# EAGLE design POV3_singleside (EAGLE 6.4)
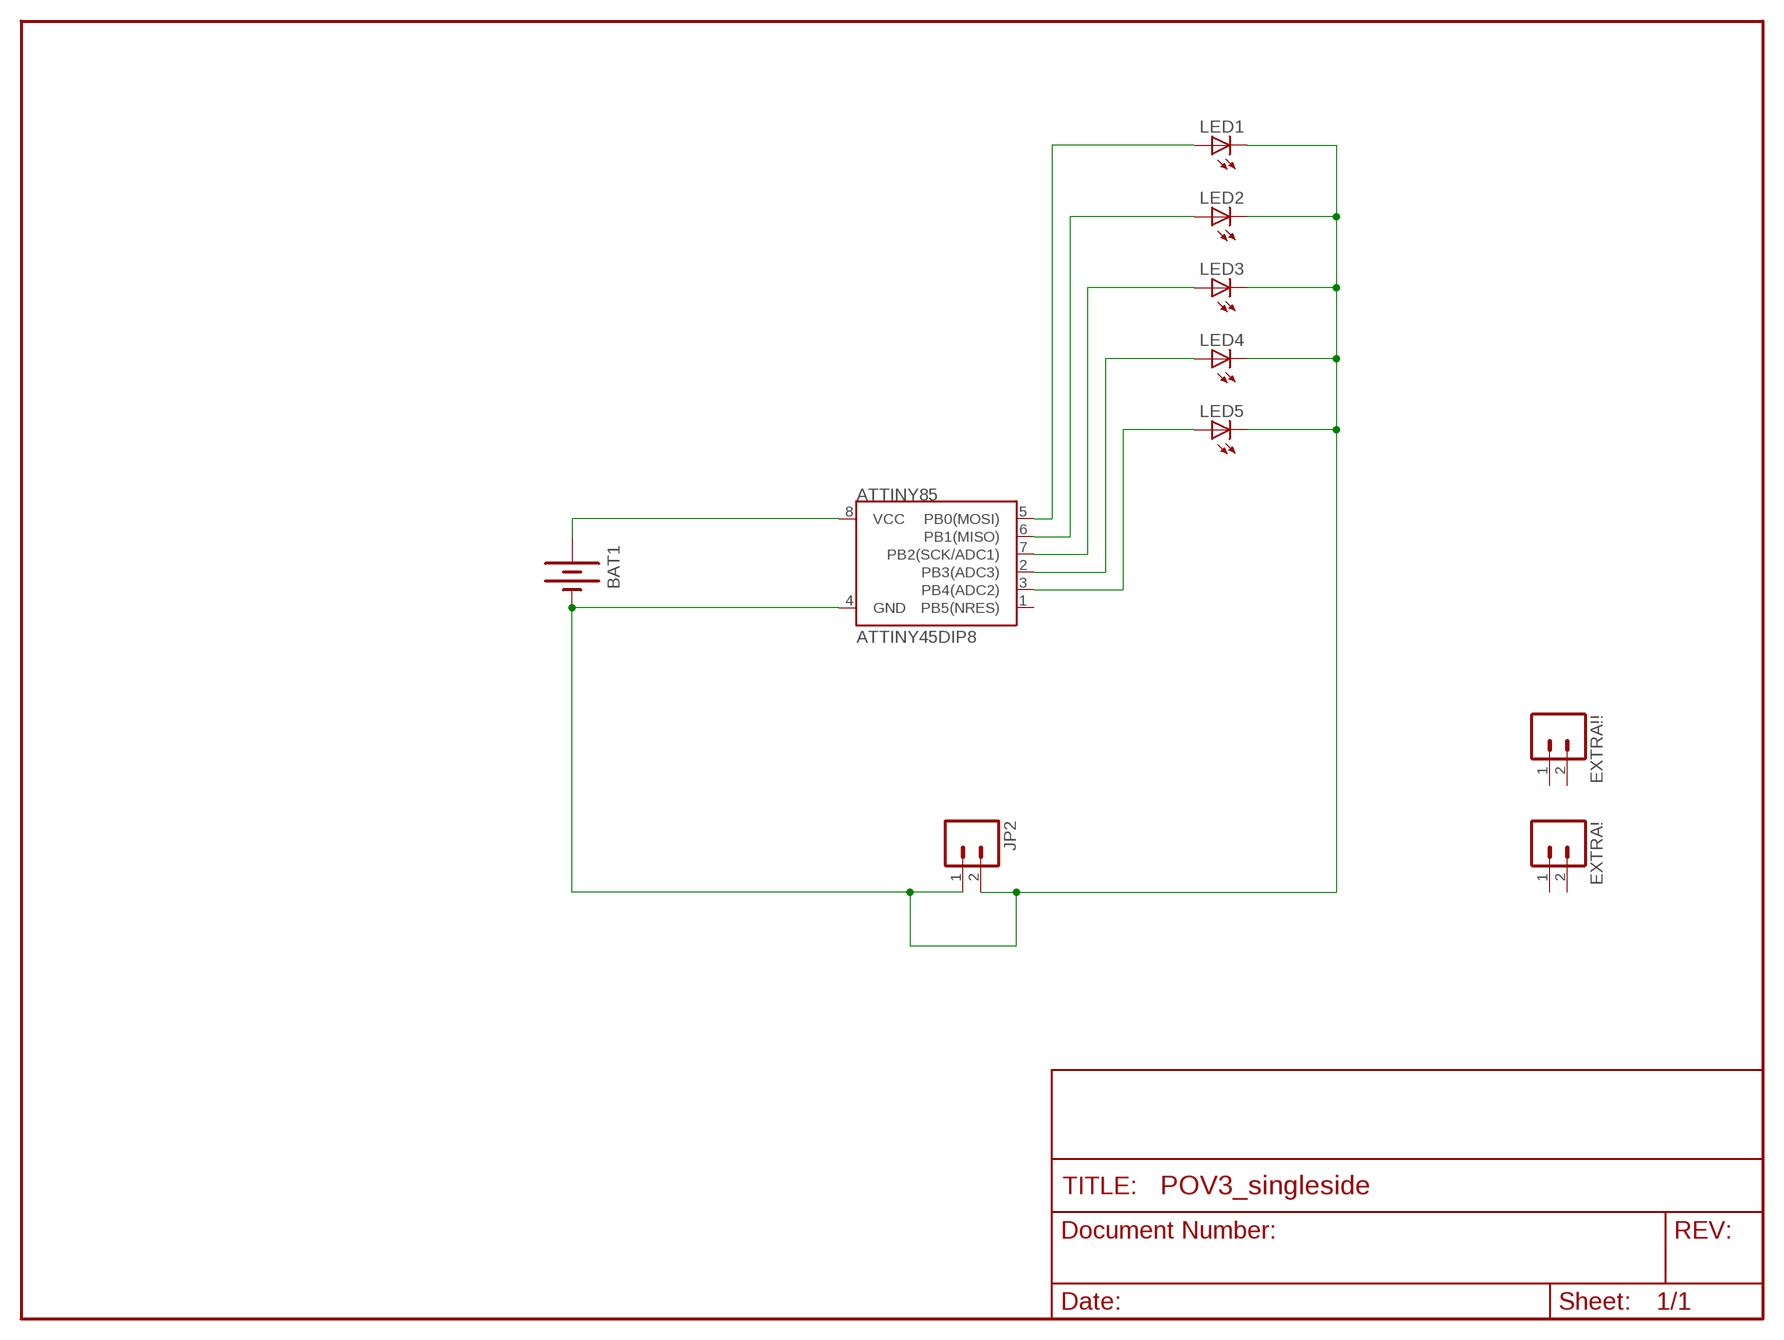
[diagram p0: schematic, sheet 1]

## Parts
ATTINY85  ATTINY45DIP8  [DIP08]
BAT1  BATTERY20PTH  [BATTCOM_20MM_PTH]
EXTRA!  M02PTH  [1X02]
EXTRA!!  M02PTH  [1X02]
JP2  M02PTH  [1X02]
LED1  LED5MM  [LED5MM]
LED2  LED5MM  [LED5MM]
LED3  LED5MM  [LED5MM]
LED4  LED5MM  [LED5MM]
LED5  LED5MM  [LED5MM]

## Nets
N$1: ATTINY85.8(VCC) BAT1.1(+)
N$3: ATTINY85.5(PB0(MOSI)) LED1.A
N$4: ATTINY85.6(PB1(MISO)) LED2.A
N$5: ATTINY85.7(PB2(SCK/ADC1)) LED3.A
N$6: ATTINY85.2(PB3(ADC3)) LED4.A
N$7: ATTINY85.3(PB4(ADC2)) LED5.A
N$9: ATTINY85.4(GND) BAT1.2(-) JP2.1 JP2.2 LED1.K(C) LED2.K(C) LED3.K(C) LED4.K(C) LED5.K(C)
Unconnected: ATTINY85.1(PB5(NRES)) EXTRA!!.1 EXTRA!!.2 EXTRA!.1 EXTRA!.2

## Library data of the parts
ATTINY85 = SparkFun:ATTINY45: Atmel ATTiny45
BAT1 = SparkFun:BATTERY: Battery Holders Various common sizes : AA, AAA, 20mm coin cell and 12mm coin cell.
EXTRA! EXTRA!! JP2 = SparkFun:M02: Header 2 Standard 2-pin 0.1" header. Use with straight break away headers (SKU : PRT-00116), right angle break away headers (PRT-00553), swiss pins (PRT-00743), machine pins (PRT-00117), and female headers (PRT-00115). Molex polarized connector foot print use with SKU : PRT-08233 with associated crimp pins and housings.
LED1-LED5 = SparkFun:LED: LEDs Standard schematic elements and footprints for 5mm, 3mm, 1206, and 0603 sized LEDs. 5mm - Spark Fun Electronics SKU : COM-00529 (and others)

## Board
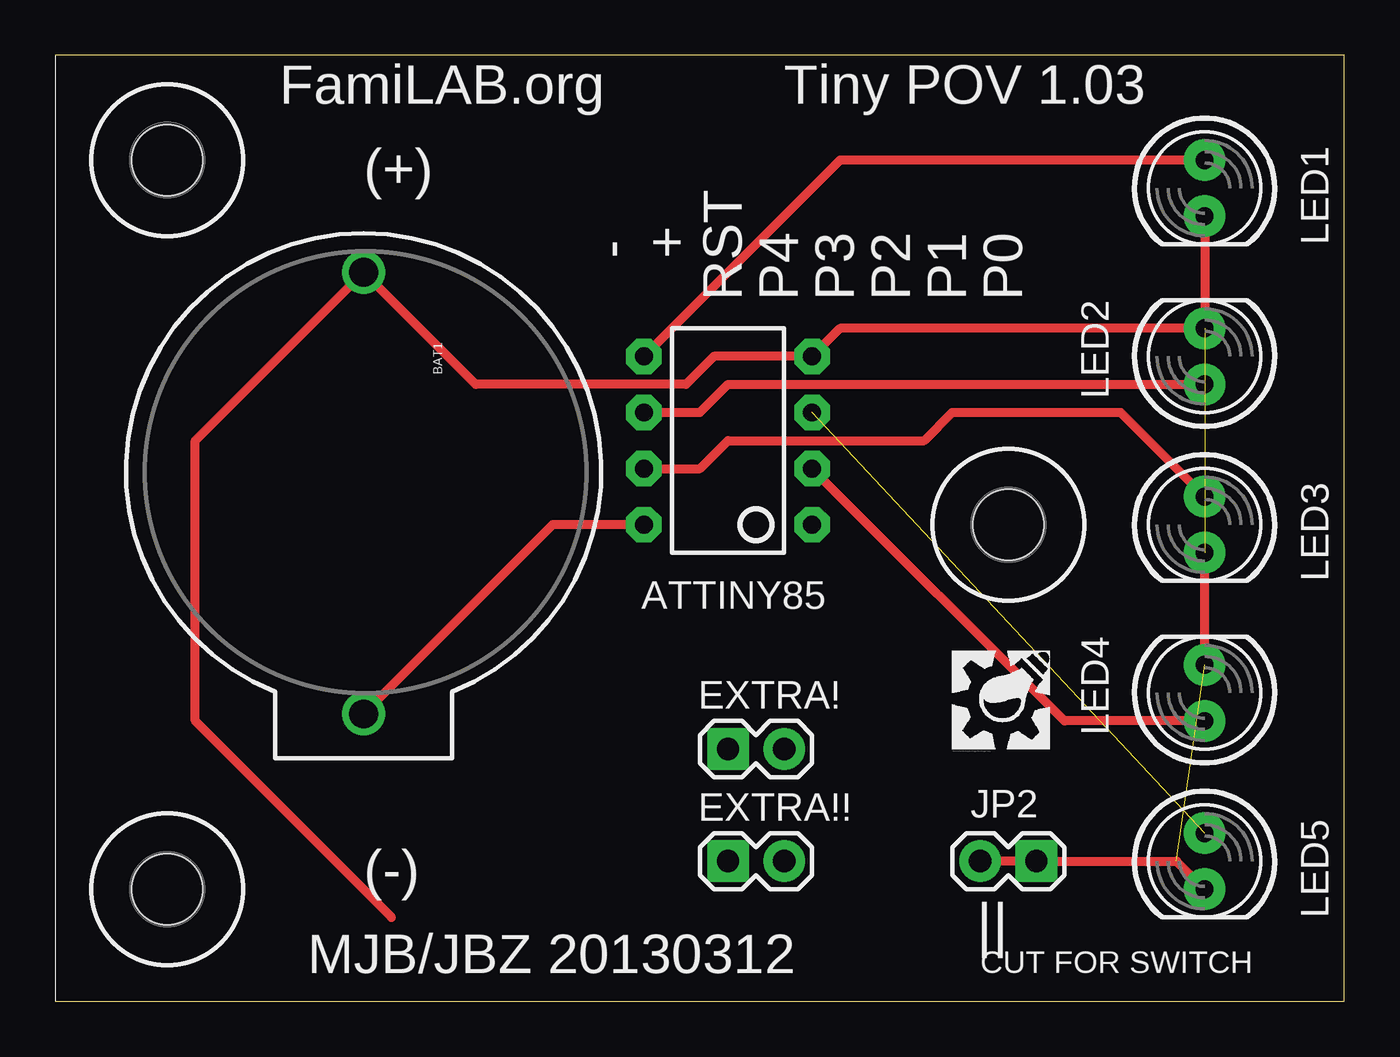
[diagram p1: board, top side]

Size 58.4 x 42.85 mm. Coordinates in mm from the lower left corner, seen from the top.
Outline: 0,0 58.4,0 58.4,42.85 0,42.85
Copper layers (1*16): Top 0.035mm / dielectric 1.5mm / Bottom 0.035mm
Design rules "default": minimum track width 10mil, minimum drill 24mil, track to track 8mil, track to pad 8mil, pad to pad 8mil, via to via 8mil, smd to smd 8mil, copper to edge 40mil, drill to drill 8mil, minimum pad ring 10mil, minimum via ring 8mil, stop-mask expansion 4mil, vias tented up to drill 0mil, thermal gap 10mil

### Footprints (pad centres in the part's own frame; a part is rotated, then mirrored left to right if it is on the bottom)
DIP08 = drill 0.813 pad 1.6 octagon: 1 -3.81,-3.81; 2 -1.27,-3.81; 3 1.27,-3.81; 4 3.81,-3.81; 5 3.81,3.81; 6 1.27,3.81; 7 -1.27,3.81; 8 -3.81,3.81
BATTCOM_20MM_PTH = drill 1.3: 1 20,0; 2 0,0
1X02 = drill 1.016 pad 1.88 square: 1 0,0 | drill 1.016 pad 1.88: 2 2.54,0
LED5MM = drill 0.813 pad 1.88: A -1.27,0; K 1.27,0
3,2 = hole 3.2: 0,0

### Placement (x,y rotation side)
ATTINY85  30.48,25.4 90 top
BAT1  13.97,33.02 270 top
EXTRA!  30.48,11.43 0 top
EXTRA!!  30.48,6.35 0 top
JP2  44.45,6.35 180 top
LED1  52.07,36.83 270 top
LED2  52.07,29.21 90 top
LED3  52.07,21.59 270 top
LED4  52.07,13.97 90 top
LED5  52.07,6.35 270 top
U$1  [FAMILAB]  40.64,11.43 0 top
U$2  [3,2]  5.08,5.08 0 top
U$3  [3,2]  5.08,38.1 0 top
U$4  [3,2]  43.18,21.59 0 top

### Tracks (layer width: path | path; a pad name or v marks a point on that pad's centre or on a via)
N$1
  Top 0.406: ATTINY85.8 22.54,21.59 BAT1.1
N$3
  Top 0.406: LED1.A 35.56,38.1 ATTINY85.5
N$4
  Top 0.406: ATTINY85.6 29.21,26.67 30.48,27.94 LED2.A
N$5
  Top 0.406: ATTINY85.7 29.21,24.13 30.48,25.4 39.37,25.4 40.64,26.67 48.26,26.67 LED3.A
N$6
  Top 0.406: LED4.A 45.72,12.7 ATTINY85.2
N$7  (1 unrouted)
N$9  (2 unrouted)
  Top 0.406: LED5.K 50.8,6.35 JP2.1 JP2.2 | LED1.K LED2.K 35.56,30.48 ATTINY85.4 29.84,29.21 28.57,27.94 19.05,27.94 BAT1.2 6.35,25.4 6.35,12.7 15.24,3.81 | LED4.K LED3.K

### Text on the board
_tsilk: FamiLAB.org | Tiny POV 1.03 | (+) | - | + | RST | P4 | P3 | P2 | P1 | P0 | (-) | || | MJB/JBZ 20130312 | CUT FOR SWITCH